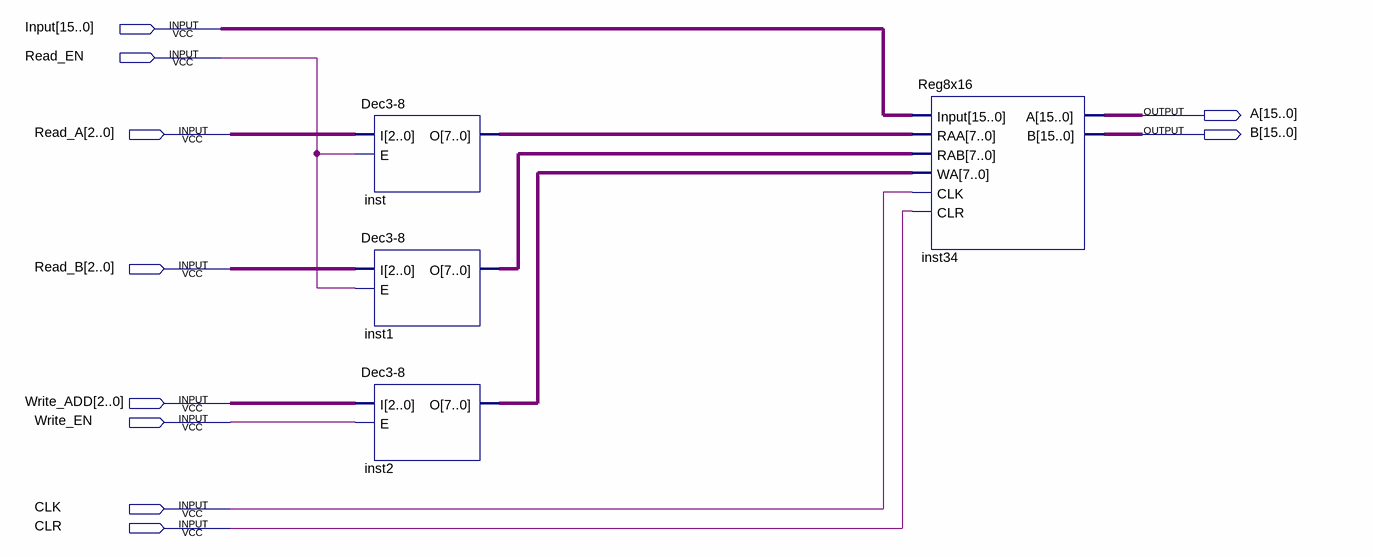
[diagram p0: schematic sheet]
// Quartus schematic FULL_REG8X16.bdf as structural Verilog: 4 symbols, 10 pins
module FULL_REG8X16 (
  input  [15:0] Input,
  input  Read_EN,
  input  [2:0] Read_A,
  input  [2:0] Read_B,
  input  [2:0] Write_ADD,
  input  Write_EN,
  input  CLK,
  input  CLR,
  output [15:0] A,
  output [15:0] B
);

  wire [7:0] inst1_o, inst2_o, inst_o;

  \Dec3-8  inst (.I(Read_A), .E(Read_EN), .O(inst_o));
  \Dec3-8  inst1 (.I(Read_B), .E(Read_EN), .O(inst1_o));
  \Dec3-8  inst2 (.I(Write_ADD), .E(Write_EN), .O(inst2_o));
  Reg8x16 inst34 (.Input(Input), .RAA(inst_o), .RAB(inst1_o), .WA(inst2_o), .CLK(CLK), .CLR(CLR), .A(A), .B(B));
endmodule
